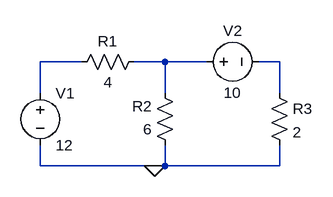
[diagram p0: schematic Draft10.asc]
Draft10.asc, the LTspice schematic file:
Version 4
SHEET 1 880 680
WIRE 128 64 64 64
WIRE 256 64 208 64
WIRE 320 64 256 64
WIRE 432 64 400 64
WIRE 64 112 64 64
WIRE 256 112 256 64
WIRE 432 112 432 64
WIRE 64 224 64 192
WIRE 240 224 64 224
WIRE 256 224 256 192
WIRE 256 224 240 224
WIRE 432 224 432 192
WIRE 432 224 256 224
FLAG 240 224 0
SYMBOL voltage 64 96 R0
SYMATTR InstName V1
SYMATTR Value 12
SYMBOL res 224 48 R90
WINDOW 0 0 56 VBottom 2
WINDOW 3 32 56 VTop 2
SYMATTR InstName R1
SYMATTR Value 4
SYMBOL res 272 208 R180
WINDOW 0 36 76 Left 2
WINDOW 3 36 40 Left 2
SYMATTR InstName R2
SYMATTR Value 6
SYMBOL voltage 304 64 R270
WINDOW 0 32 56 VTop 2
WINDOW 3 -32 56 VBottom 2
SYMATTR InstName V2
SYMATTR Value 10
SYMBOL res 416 96 R0
SYMATTR InstName R3
SYMATTR Value 2

The netlist it stands for:
* Draft10.asc
V1 N001 0 12
R1 N002 N001 4
R2 0 N002 6
V2 N002 N003 10
R3 N003 0 2
.backanno
.end